# Altium schematic sheet PD300.SchDoc
size A4; PageSetup: Record=PageOptions|CenterHorizontal=True|CenterVertical=True|PrintScale=1.00|XCorrection=1.00|YCorrection=1.00|PrintKind=0|BorderSize=5000000|LeftOffset=0|BottomOffset=0|Orientation=2|PaperLength=1000|PaperWidth=1000|Scale=100|PaperSource=7|PrintQuality=-3|MediaType=1|DitherType=10|PrintScaleMode=1|PaperKind=A4|PaperIndex=9
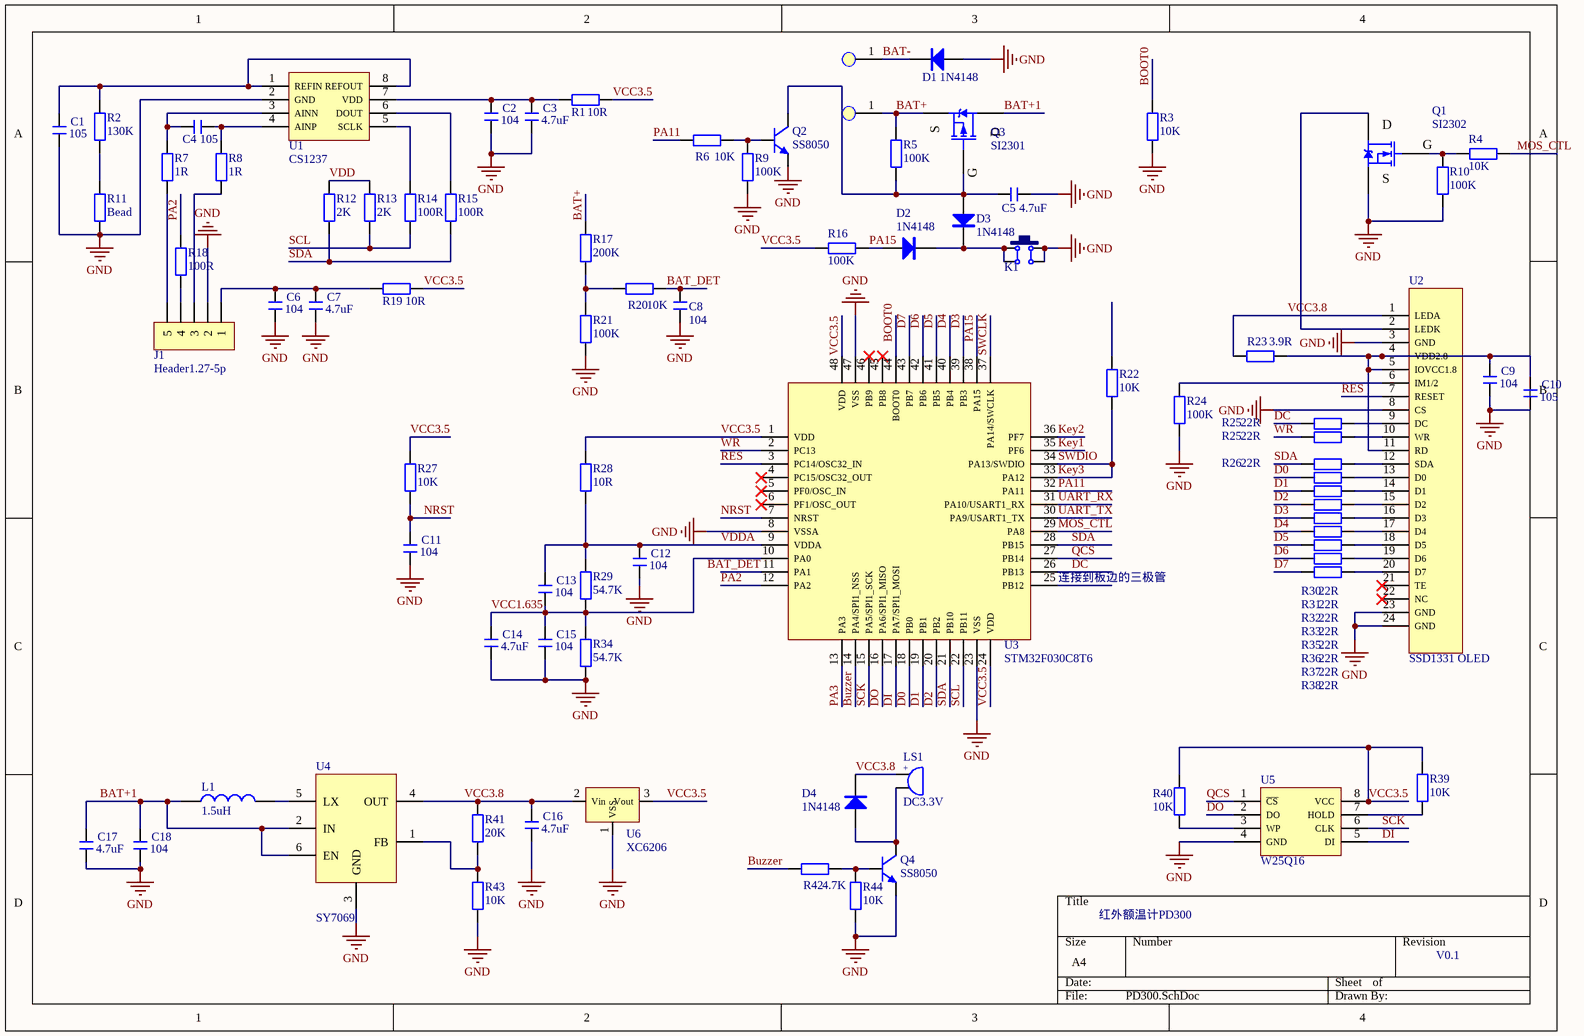
[diagram p0: PD300.SchDoc]

## Parts
(Parts that share a designator on the sheet are numbered #1, #2 ... from top to bottom, then left to right.)
C1  105  [C 0603_L]
C2  104  [C 0603_L]
C3  4.7uF  [C 0603_L]
C4  105  [C 0603_L]
C5  4.7uF  [C 0603_L]
C6  104  [C 0603_L]
C7  4.7uF  [C 0603_L]
C8  104  [C 0603_L]
C9  104  [C 0603_L]
C10  105  [C 0603_L]
C11  104  [C 0603_L]
C12  104  [C 0603_L]
C13  104  [C 0603_L]
C14  4.7uF  [C 0603_L]
C15  104  [C 0603_L]
C16  4.7uF  [C 0603_L]
C17  4.7uF  [C 0603_L]
C18  104  [C 0603_L]
D1  1N4148  [SOD-323]
D2  1N4148  [SOD-323]
D3  1N4148  [SOD-323]
D4  1N4148  [SOD-323]
J1  Header1.27-5p  [Header1.27SMD-5P]
K1  KeySmd5.2*5.2  [KeySmd5.2*5.2]  (value not drawn)
L1  1.5uH  [L 0402]
LS1  DC3.3V  [BEEP 5x9x5.5]
Q1  SI2302  [SOT23-3N]
Q2  SS8050  [SOT23-3N]
Q3  SI2301  [SOT23-3N]
Q4  SS8050  [SOT23-3N]
R1  10R  [R 0603_L]
R2  130K  [R 0603_L]
R3  10K  [R 0603_L]
R4  10K  [R 0603_L]
R5  100K  [R 0603_L]
R6  10K  [R 0603_L]
R7  1R  [R 0603_L]
R8  1R  [R 0603_L]
R9  100K  [R 0603_L]
R10  100K  [R 0603_L]
R11  Bead  [R 0603_L]
R12  2K  [R 0603_L]
R13  2K  [R 0603_L]
R14  100R  [R 0603_L]
R15  100R  [R 0603_L]
R16  100K  [R 0603_L]
R17  200K  [R 0603_L]
R18  100R  [R 0603_L]
R19  10R  [R 0603_L]
R20  10K  [R 0603_L]
R21  100K  [R 0603_L]
R22  10K  [R 0603_L]
R23  3.9R  [R 0603_L]
R24  100K  [R 0603_L]
R25#1  22R  [R 0603_L]
R25#2  22R  [R 0603_L]
R26  22R  [R 0603_L]
R27  10K  [R 0603_L]
R28  10R  [R 0603_L]
R29  54.7K  [R 0603_L]
R30  22R  [R 0603_L]
R31  22R  [R 0603_L]
R32  22R  [R 0603_L]
R33  22R  [R 0603_L]
R34  54.7K  [R 0603_L]
R35  22R  [R 0603_L]
R36  22R  [R 0603_L]
R37  22R  [R 0603_L]
R38  22R  [R 0603_L]
R39  10K  [R 0603_L]
R40  10K  [R 0603_L]
R41  20K  [R 0603_L]
R42  4.7K  [R 0603_L]
R43  10K  [R 0603_L]
R44  10K  [R 0603_L]
TP1#1  TP1  [TP1]  (value not drawn)
TP1#2  TP1  [TP1]  (value not drawn)
U1  CS1237  [SOP8_N]
U2  SSD1331 OLED
U3  STM32F030C8T6  [LQFP48-7*7]
U4  SY7069  [SOT23-5N]
U5  W25Q16  [SOP8-W2.54_N]
U6  XC6206  [SOT-23]

## Nets
GND: C1.1 C2.1 C3.1 C5.1 C6.1 C7.1 C8.2 C9.1 C10.1 C11.1 C12.1 C14.1 C15.1 C16.1 C17.1 C18.1 D1.1(A) J1.2 K1.2 K1.3 Q1.2(S) Q2.2(E) Q4.2(E) R3.2 R9.1 R10.1 R11.1 R21.1 R24.1 R34.2 R43.2 R44.1 U1.2(GND) U2.3(GND) U2.8(CS) U2.23(GND) U2.24(GND) U3.8(VSSA) U3.23(VSS) U3.47(VSS) U4.3(GND) U5.4(GND) U6.1(VSS)
BAT+: Q3.2(S) R5.2 R17.2 TP1#2.1
BAT+1: C17.2 C18.2 L1.1 Q3.3(D) U4.2(IN) U4.6(EN)
BAT-: D1.2(K) TP1#1.1
BAT_DET: C8.1 R20.1
BOOT0: R3.1 U3.44(BOOT0)
Buzzer: R42.2 U3.14(PA4/SPI1_NSS)
D0: R30.1 U3.18(PB0)
D1: R31.1 U3.19(PB1)
D2: R32.1 U3.20(PB2)
D3: R33.1 U3.39(PB3)
D4: R35.1 U3.40(PB4)
D5: R36.1 U3.41(PB5)
D6: R37.1 U3.42(PB6)
D7: R38.1 U3.43(PB7)
DC: R25#1.1 U3.26(PB13)
DI: U3.17(PA7/SPI1_MOSI) U5.5(DI)
DO: U3.16(PA6/SPI1_MISO) U5.2(DO)
Key1: U3.35(PF6)
Key2: U3.36(PF7)
Key3: R22.2 U3.33(PA12) U3.34(PA13/SWDIO)  [also labelled SWDIO]
MOS_CTL: R4.1 U3.29(PA8)
NRST: C11.2 R27.2 U3.7(NRST)
PA2: R18.1 U3.12(PA2)
PA3: U3.13(PA3)
PA11: R6.2 U3.32(PA11)
PA15: D2.1(A) R16.1 U3.38(PA15)
QCS: U3.27(PB14) U5.1(~{C}~{S})
RES: U2.7(RESET) U3.3(PC14/OSC32_IN)
SCK: U3.15(PA5/SPI1_SCK) U5.6(CLK)
SCL: R13.2 R14.1 U3.22(PB11)
SDA: R12.2 R15.1 R26.1 U3.21(PB10) U3.28(PB15)
SWCLK: U3.37(PA14/SWCLK)
UART_RX: U3.31(PA10/USART1_RX)
UART_TX: U3.30(PA9/USART1_TX)
VCC1.635: C13.1 C14.2 C15.2 R29.2 R34.1 U3.10(PA0)
VCC3.5: R1.1 R16.2 R19.1 R27.1 R28.1 R39.2 R40.2 U3.1(VDD) U3.24(VDD) U3.48(VDD) U5.8(VCC) U6.3(Vout)
VCC3.8: C16.2 D4.2(K) LS1.1 R23.1 R41.1 U2.1(LEDA) U4.4(OUT) U6.2(Vin)
VDD: R12.1 R13.1
VDDA: C12.2 C13.2 R28.2 R29.1 U3.9(VDDA)
WR: R25#2.1 U3.2(PC13)
NetC1_2: C1.2 R2.2 U1.1(REFIN) U1.8(REFOUT)
NetC2_2: C2.2 C3.2 R1.2 U1.7(VDD)
NetC4_1: C4.1 R8.2 U1.4(AINP)
NetC4_2: C4.2 R7.1 U1.3(AINN)
NetC5_2: C5.2 D3.1(A) Q2.3(C) Q3.1(G) R5.1
NetC6_2: C6.2 C7.2 J1.1 R19.2
NetC9_2: C9.2 C10.2 R23.2 U2.4(VDD2.8) U2.5(IOVCC1.8) U2.11(RD)
NetD2_2: D2.2(K) D3.2(K) K1.1 K1.4
NetD4_1: D4.1(A) LS1.2 Q4.3(C)
NetJ1_3: J1.3 R8.1
NetJ1_4: J1.4 R18.2
NetJ1_5: J1.5 R7.2
NetL1_2: L1.2 U4.5(LX)
NetQ1_1: Q1.1(G) R4.2 R10.2
NetQ1_3: Q1.3(D) U2.2(LEDK)
NetQ2_1: Q2.1(B) R6.1 R9.2
NetQ4_1: Q4.1(B) R42.1 R44.2
NetR2_1: R2.1 R11.2
NetR14_2: R14.2 U1.5(SCLK)
NetR15_2: R15.2 U1.6(DOUT)
NetR17_1: R17.1 R20.2 R21.2
NetR24_2: R24.2 U2.6(IM1/2)
NetR25#1_2: R25#1.2 U2.9(DC)
NetR25#2_2: R25#2.2 U2.10(WR)
NetR26_2: R26.2 U2.12(SDA)
NetR30_2: R30.2 U2.13(D0)
NetR31_2: R31.2 U2.14(D1)
NetR32_2: R32.2 U2.15(D2)
NetR33_2: R33.2 U2.16(D3)
NetR35_2: R35.2 U2.17(D4)
NetR36_2: R36.2 U2.18(D5)
NetR37_2: R37.2 U2.19(D6)
NetR38_2: R38.2 U2.20(D7)
NetR39_1: R39.1 U5.7(HOLD)
NetR40_1: R40.1 U5.3(WP)
NetR41_2: R41.2 R43.1 U4.1(FB)

Not connected (* = marked no-connect by the designer): R22 1; U2 21(TE)* 22(NC)*; U3 4(PC15/OSC32_OUT)* 5(PF0/OSC_IN)* 6(PF1/OSC_OUT)* 11(PA1) 25(PB12) 45(PB8)* 46(PB9)*

## Notes on the sheet
- (near U3) 连接到板边的三极管
- 红外额温计PD300
- V0.1
- Labels drawn without touching a wire or pin: BAT_DET
- (in symbol BEEP) +

## Library data of the parts
C1-C18 = C0603: 无极性贴片电容; 淘宝店铺: love2015you; BOM名称: 无极性贴片电容
D1-D4 = 1N4148: 高速开关二极管; 淘宝店铺: love2015you; BOM名称: 高速开关二极管
L1 = L: 小功率贴片电感; 淘宝店铺: love2015you; BOM名称: 小功率贴片电感
LS1 = BEEP: 蜂鸣器; 淘宝店铺: love2015you; BOM名称: 蜂鸣器
Q1 = SI2302: N沟道场效应管; 淘宝店铺: love2015you; BOM名称: N沟道场效应管
Q2 Q4 = 8050-SMD: 高频放大-NPN型; 属性: 40V 1.5A 1W 100MHZ; 淘宝店铺: love2015you; BOM名称: 高频放大-NPN型
Q3 = SI2301: P沟道场效应管; 淘宝店铺: love2015you; BOM名称: P沟道场效应管
R1-R24 R25#1 R25#2 R26-R44 = R0603: 贴片电阻; 淘宝店铺: love2015you; BOM名称: 贴片电阻
U2 = SSD1331